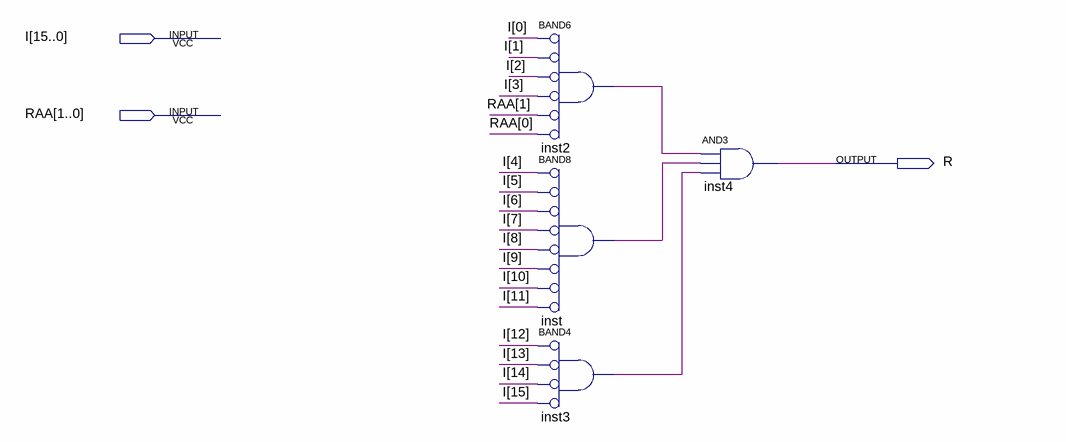
[diagram p0: schematic sheet]
// Quartus schematic zero_4bit.bdf as structural Verilog: 4 symbols, 3 pins
module zero_4bit (
  input  [15:0] I,
  input  [1:0] RAA,
  output R
);

  wire inst2_out, inst3_out, inst_out;

  and inst2 (inst2_out, ~I[0], ~I[1], ~I[2], ~I[3], ~RAA[1], ~RAA[0]);  // BAND6
  and inst (inst_out, ~I[4], ~I[5], ~I[6], ~I[7], ~I[8], ~I[9], ~I[10], ~I[11]);  // BAND8
  and inst3 (inst3_out, ~I[12], ~I[13], ~I[14], ~I[15]);  // BAND4
  and inst4 (R, inst2_out, inst_out, inst3_out);
endmodule
